# Altium project LPCB281__RLOOP__APU.PrjPCB
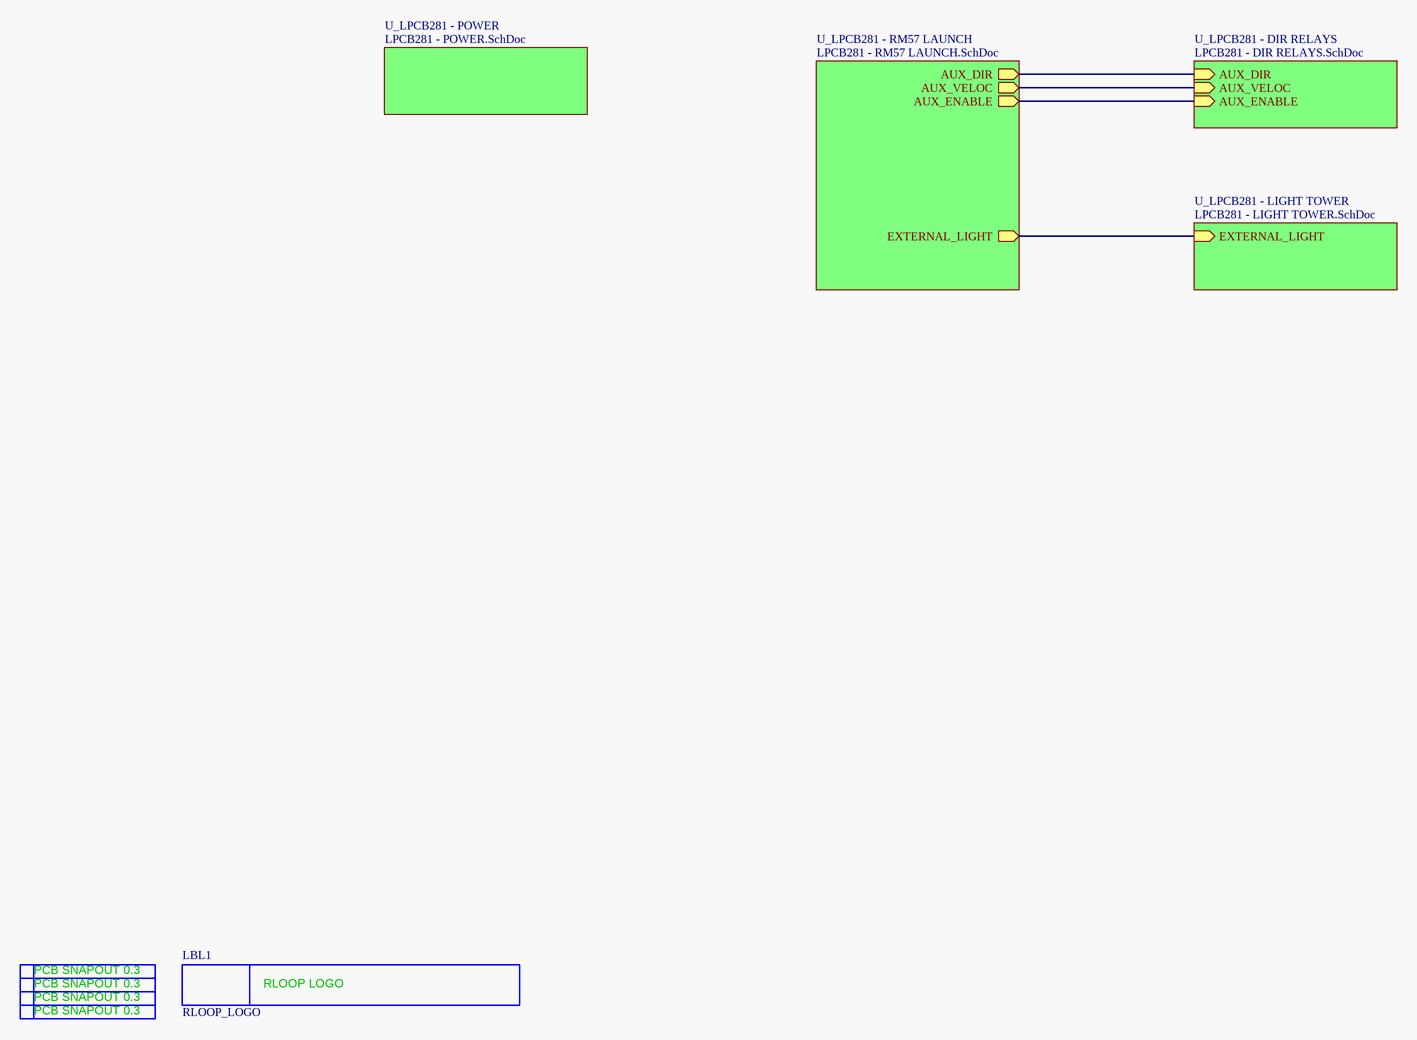
[diagram p0: LPCB281 - TOP.SchDoc]
5 sheets, 39 parts. Net scope: hierarchical (ports join the sheet entries above them; power ports are global).
Board files: LPCB281R0.PcbDoc, LPCB281R0__ASCII.PcbDoc
Sheets:
  LPCB281 - TOP.SchDoc
    U_LPCB281 - RM57 LAUNCH = LPCB281 - RM57 LAUNCH.SchDoc
    U_LPCB281 - POWER = LPCB281 - POWER.SchDoc
    U_LPCB281 - LIGHT TOWER = LPCB281 - LIGHT TOWER.SchDoc
    U_LPCB281 - DIR RELAYS = LPCB281 - DIR RELAYS.SchDoc

## Sheet LPCB281 - TOP.SchDoc
size A3; Address1: Factory 10; Address2: 9-13 Dingley Avenue, Dandeong, VICTORIA 3175, AUSTRALIA; DocumentNumber: 1; Revision: 1; SheetNumber: 1; SheetTotal: 5; Lockie__PCB_SUB_ASSEMBLY: PCB Sub Component; Lockie__PCB_ASSEMBLY: PCB Assembly; Lockie__LDL: LPCB281; Lockie__PCB_DESCRIPTION: Aux Prop Unit (APU)

### Parts
LBL1  RLOOP_LOGO  [RLOOP_LOGO]  (no BOM)
SN1  PCB_SNAPOUT_0.3MM  [PCB_SNAPOUT_0.3MM]  (value not drawn)  (no BOM)
SN2  PCB_SNAPOUT_0.3MM  [PCB_SNAPOUT_0.3MM]  (value not drawn)  (no BOM)
SN3  PCB_SNAPOUT_0.3MM  [PCB_SNAPOUT_0.3MM]  (value not drawn)  (no BOM)
SN4  PCB_SNAPOUT_0.3MM  [PCB_SNAPOUT_0.3MM]  (value not drawn)  (no BOM)

### Sub-sheets
U_LPCB281 - DIR RELAYS = LPCB281 - DIR RELAYS.SchDoc: AUX_DIR (in), AUX_VELOC (in), AUX_ENABLE (in)
U_LPCB281 - LIGHT TOWER = LPCB281 - LIGHT TOWER.SchDoc: EXTERNAL_LIGHT (in)
U_LPCB281 - POWER = LPCB281 - POWER.SchDoc: no entries
U_LPCB281 - RM57 LAUNCH = LPCB281 - RM57 LAUNCH.SchDoc: AUX_VELOC (out), AUX_DIR (out), AUX_ENABLE (out), EXTERNAL_LIGHT (out)

### Nets
AUX_DIR: sheet U_LPCB281 - RM57 LAUNCH/AUX_DIR, sheet U_LPCB281 - DIR RELAYS/AUX_DIR
AUX_ENABLE: sheet U_LPCB281 - RM57 LAUNCH/AUX_ENABLE, sheet U_LPCB281 - DIR RELAYS/AUX_ENABLE
AUX_VELOC: sheet U_LPCB281 - RM57 LAUNCH/AUX_VELOC, sheet U_LPCB281 - DIR RELAYS/AUX_VELOC
NetCN6_J4_8: sheet U_LPCB281 - RM57 LAUNCH/EXTERNAL_LIGHT, sheet U_LPCB281 - LIGHT TOWER/EXTERNAL_LIGHT

### Notes on the sheet
- PCB COMPONENT DESCRIPTION
- LDL NUMBER
- Assembly Details
- Size
- Drawing File Name
- Revision
- http://sil3.com.au
  ACN: 123 529 064
  Factory 10
  9-13 Dingley Avenue
  Dandenong, VICTORIA
  Australia
- Scale
- A3
- Sheet Details
- N.T.S
- Sheet:
- Of:
- (in symbol PCB_SNAPOUT_0.3MM) PCB SNAPOUT 0.3
- (in symbol RLOOP_LOGO) RLOOP LOGO

### Library data of the parts
LBL1 = RLOOP_LOGO: FMEDA__CHANNEL: DIAG; FMEDA__FUNCTION_IN_SYSTEM: *
SN1-SN4 = PCB_SNAPOUT_0.3MM: PCB Snapout + 0.3mm; FMEDA__CHANNEL: DIAG; FMEDA__FUNCTION_IN_SYSTEM: *

## Sheet LPCB281 - RM57 LAUNCH.SchDoc
size A3; Address1: Factory 10; Address2: 9-13 Dingley Avenue, Dandeong, VICTORIA 3175, AUSTRALIA; DocumentNumber: 5; Revision: 1; SheetNumber: 5; SheetTotal: 5; Lockie__PCB_SUB_ASSEMBLY: PCB Sub Component; Lockie__PCB_ASSEMBLY: PCB Assembly; Lockie__LDL: LPCB281; Lockie__PCB_DESCRIPTION: Aux Prop Unit (APU)
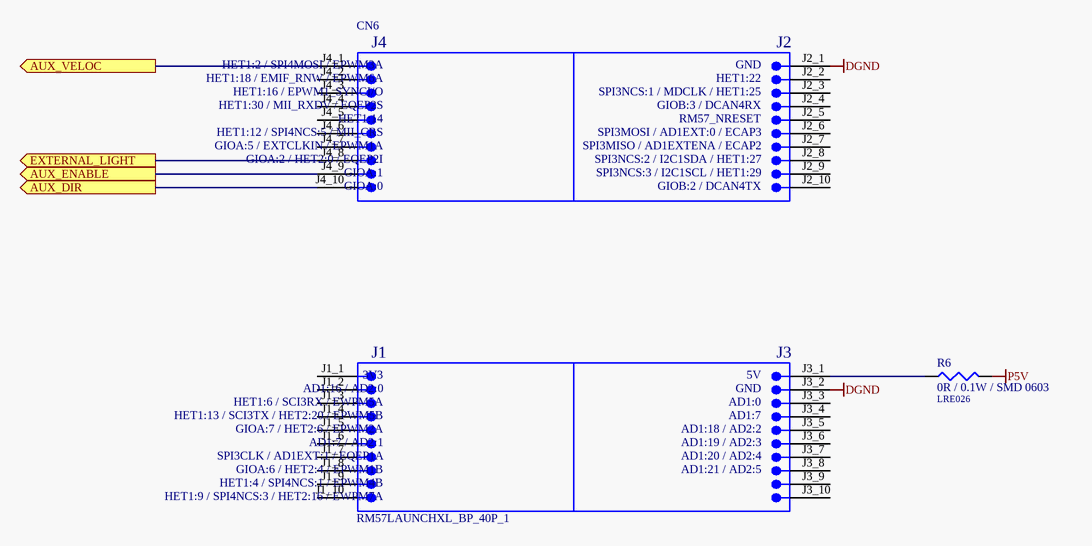
[diagram p1: LPCB281 - RM57 LAUNCH.SchDoc]

### Parts
CN6  RM57LAUNCHXL_BP_40P_1  [RM57LAUNCHXL_BP_40P_1]  (no BOM)
R6  0R / 0.1W / SMD 0603  LDL_NUMBER: LRE026  [LFP020__CR1608-0603-IPC7351_B]

### Ports
AUX_DIR (out), AUX_ENABLE (out), AUX_VELOC (out), EXTERNAL_LIGHT (out)

### Nets
DGND: CN6.J2_1 CN6.J3_2
P5V: R6.2
AUX_DIR: CN6.J4_10 ; port AUX_DIR
AUX_ENABLE: CN6.J4_9 ; port AUX_ENABLE
AUX_VELOC: CN6.J4_1 ; port AUX_VELOC
NetCN6_J3_1: CN6.J3_1 R6.1
NetCN6_J4_8: CN6.J4_8 ; port EXTERNAL_LIGHT

Not connected (* = marked no-connect by the designer): CN6 J1_1 J1_2 J1_3 J1_4 J1_5 J1_6 J1_7 J1_8 J1_9 J1_10 J2_2 J2_3 J2_4 J2_5 J2_6 J2_7 J2_8 J2_9 J2_10 J3_3 J3_4 J3_5 J3_6 J3_7 J3_8 J3_9 J3_10 J4_2 J4_3 J4_4 J4_5 J4_6 J4_7

### Notes on the sheet
- PCB COMPONENT DESCRIPTION
- LDL NUMBER
- Assembly Details
- Size
- Drawing File Name
- Revision
- http://sil3.com.au
  ACN: 123 529 064
  Factory 10
  9-13 Dingley Avenue
  Dandenong, VICTORIA
  Australia
- Scale
- A3
- Sheet Details
- N.T.S
- Sheet:
- Of:
- (in symbol RM57LAUNCHXL_BP_40P_1) J4; J2; HET1:2 / SPI4MOSI / EPWM3A; GND; HET1:18 / EMIF_RNW / EPWM6A; HET1:22; HET1:16 / EPWM1_SYNCI/O; SPI3NCS:1 / MDCLK / HET1:25; HET1:30 / MII_RXDV / EQEP2S; GIOB:3 / DCAN4RX; HET1:14; RM57_NRESET; HET1:12 / SPI4NCS:5 / MII_CRS; SPI3MOSI / AD1EXT:0 / ECAP3; GIOA:5 / EXTCLKIN / EPWM1A; SPI3MISO / AD1EXTENA / ECAP2; GIOA:2 / HET2:0 / EQEP2I; SPI3NCS:2 / I2C1SDA / HET1:27; GIOA:1; SPI3NCS:3 / I2C1SCL / HET1:29; GIOA:0; GIOB:2 / DCAN4TX; J1; J3; 3V3; 5V; AD1:16 / AD2:0; HET1:6 / SCI3RX / EWPM5A; AD1:0; HET1:13 / SCI3TX / HET2:20 / EPWM5B; AD1:7; GIOA:7 / HET2:6 / EPWM2A; AD1:18 / AD2:2; AD1:7 / AD2:1; AD1:19 / AD2:3; SPI3CLK / AD1EXT:1 / EQEP1A; AD1:20 / AD2:4; GIOA:6 / HET2:4 / EPWM1B; AD1:21 / AD2:5; HET1:4 / SPI4NCS:1 / EPWM4B; HET1:9 / SPI4NCS:3 / HET2:16 / EWPM7A

### Library data of the parts
CN6 = RM57LAUNCHXL_BP_40P_1: Connector, RM57L843 LaunchXL, 40Pin Boosterpack Site1; FMEDA__CHANNEL: COM; FMEDA__OPERATING__CURRENT_MAX: 0; FMEDA__OPERATING__TEMP_MAX: 50; FMEDA__OPERATING__TEMP_MIN: -20; FMEDA__OPERATING__TEMP_TYP: 27; FMEDA__OPERATING__VOLTAGE_MAX: 16; FMEDA__OPERATING__VOLTAGE_TYP: 12; FMEDA__FUNCTION_IN_SYSTEM: *; FMEDA__OPERATING__CURRENT_MIN: 0; FMEDA__OPERATING__CURRENT_TYP: 0; FMEDA__OPERATING__VOLTAGE_MIN: 0
R6 = 0R / 0.1W / SMD 0603: Resistor, Ceramic Chip, 0R, 0.1W, SMD 0603 [LRE026]; Value: 0; FMEDA__OPERATING__TEMP_MAX: 50; FMEDA__OPERATING__TEMP_MIN: -20; FMEDA__OPERATING__TEMP_TYP: 27; FMEDA__CHANNEL: COM; FMEDA__OPERATING__POWER_MAX: 0; FMEDA__OPERATING__POWER_MIN: 0; FMEDA__OPERATING__VOLTAGE_MAX: 0; FMEDA__OPERATING__VOLTAGE_MIN: 0; FMEDA__OPERATING__VOLTAGE_TYP: 0; FMEDA__FUNCTION_IN_SYSTEM: *

## Sheet LPCB281 - POWER.SchDoc
size A3; Address1: Factory 10; Address2: 9-13 Dingley Avenue, Dandeong, VICTORIA 3175, AUSTRALIA; DocumentNumber: 4; Revision: 1; SheetNumber: 4; SheetTotal: 5; Lockie__PCB_SUB_ASSEMBLY: PCB Sub Component; Lockie__PCB_ASSEMBLY: PCB Assembly; Lockie__LDL: LPCB281; Lockie__PCB_DESCRIPTION: Aux Prop Unit (APU)
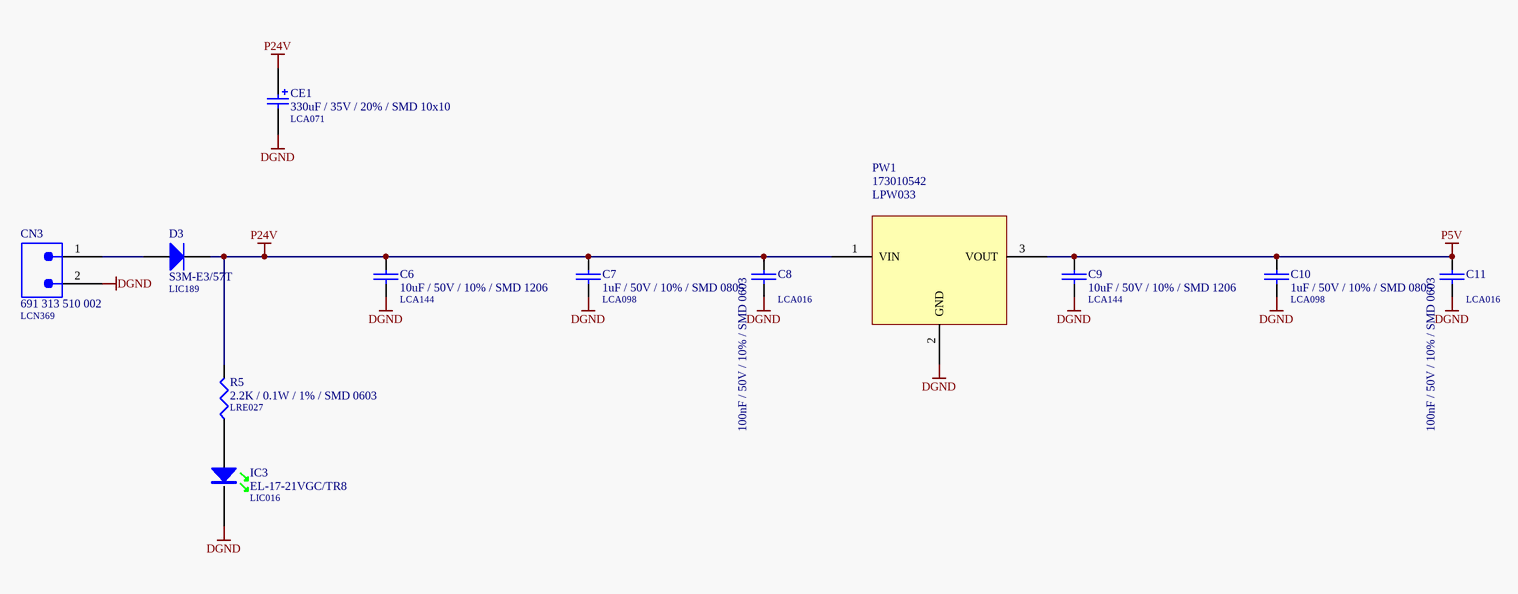
[diagram p2: LPCB281 - POWER.SchDoc]

### Parts
C6  10uF / 50V / 10% / SMD 1206  LDL_NUMBER: LCA144  [LFP043__CC3216-1206]
C7  1uF / 50V / 10% / SMD 0805  LDL_NUMBER: LCA098  [LFP010__CC2012-0805-IPC7351_B]
C8  100nF / 50V / 10% / SMD 0603  LDL_NUMBER: LCA016  [LFP011__CC1608-0603-IPC7351_B]
C9  10uF / 50V / 10% / SMD 1206  LDL_NUMBER: LCA144  [LFP043__CC3216-1206]
C10  1uF / 50V / 10% / SMD 0805  LDL_NUMBER: LCA098  [LFP010__CC2012-0805-IPC7351_B]
C11  100nF / 50V / 10% / SMD 0603  LDL_NUMBER: LCA016  [LFP011__CC1608-0603-IPC7351_B]
CE1  330uF / 35V / 20% / SMD 10x10  LDL_NUMBER: LCA071  [LFP041__NICHICON_WT_10X10]
CN3  691 313 510 002  LDL_NUMBER: LCN369  [691 313 510 002]
D3  S3M-E3/57T  LDL_NUMBER: LIC189  [LFP040__DO-214AB]
IC3  EL-17-21VGC/TR8  LDL_NUMBER: LIC016  [CR2012-0805-LED]
PW1  173010542  LDL_NUMBER: LPW033  [173010542]
R5  2.2K / 0.1W / 1% / SMD 0603  LDL_NUMBER: LRE027  [LFP020__CR1608-0603-IPC7351_B]

### Nets
DGND: C6.2 C7.2 C8.2 C9.2 C10.2 C11.2 CE1.2 CN3.2 IC3.K PW1.2(GND)
P5V: C9.1 C10.1 C11.1 PW1.3(VOUT)
P24V: C6.1 C7.1 C8.1 CE1.1 D3.1(K) PW1.1(VIN) R5.2
NetCN3_1: CN3.1 D3.2(A)
NetIC3_A: IC3.A R5.1

### Notes on the sheet
- PCB COMPONENT DESCRIPTION
- LDL NUMBER
- Assembly Details
- Size
- Drawing File Name
- Revision
- http://sil3.com.au
  ACN: 123 529 064
  Factory 10
  9-13 Dingley Avenue
  Dandenong, VICTORIA
  Australia
- Scale
- A3
- Sheet Details
- N.T.S
- Sheet:
- Of:

### Library data of the parts
C6 C9 = 10uF / 50V / 10% / SMD 1206: Capacitor, Ceramic Chip, 10uF, 50V, X5R, 10%, SMD 1206 [LCA144]; Value: 10u; FMEDA__OPERATING__TEMP_MAX: 85; FMEDA__OPERATING__TEMP_MIN: -55; FMEDA__OPERATING__TEMP_TYP: 27; FMEDA__OPERATING__VOLTAGE_MAX: 50; FMEDA__OPERATING__VOLTAGE_MIN: 0; FMEDA__CHANNEL: COM; FMEDA__FUNCTION_IN_SYSTEM: *
C7 C10 = 1uF / 50V / 10% / SMD 0805: Capacitor, Ceramic Chip, 1uF, 50V, SMD 0805 [LCA098]; Value: 1u; FMEDA__OPERATING__VOLTAGE_MAX: 3.3; FMEDA__OPERATING__VOLTAGE_MIN: 0; FMEDA__OPERATING__TEMP_MAX: 50; FMEDA__OPERATING__TEMP_MIN: -20; FMEDA__OPERATING__TEMP_TYP: 27; FMEDA__CHANNEL: COM; FMEDA__OPERATING__VOLTAGE_TYP: 3.3; FMEDA__FUNCTION_IN_SYSTEM: *
C8 C11 = 100nF / 50V / 10% / SMD 0603: Capacitor, Ceramic Chip, 100nF (0.1uF), 50V, 5%, SMD 0603 [LCA016]; Value: 100n; FMEDA__OPERATING__VOLTAGE_MIN: 0; FMEDA__OPERATING__VOLTAGE_MAX: 3.3; FMEDA__OPERATING__TEMP_MIN: -20; FMEDA__OPERATING__TEMP_TYP: 27; FMEDA__OPERATING__TEMP_MAX: 50; FMEDA__CHANNEL: COM; FMEDA__FUNCTION_IN_SYSTEM: *; FMEDA__OPERATING__VOLTAGE_TYP: 3.3
CE1 = 330uF / 35V / 20% / SMD 10x10: Capacitor, Aluminum Electrolytic, 330uF, 35V, 20%, SMD (10mm x 10mm) [LCA071]; FMEDA__OPERATING__TEMP_MAX: 50; FMEDA__OPERATING__TEMP_MIN: -20; FMEDA__OPERATING__TEMP_TYP: 27; FMEDA__OPERATING__VOLTAGE_MAX: 0; Value: 330u; FMEDA__CHANNEL: COM; FMEDA__OPERATING__VOLTAGE_MIN: 0; FMEDA__OPERATING__VOLTAGE_TYP: 0; FMEDA__FUNCTION_IN_SYSTEM: *
CN3 = 691 313 510 002: Connector, Pluggable Terminal Block, 5.08mm, 2 Way, PTH; FMEDA__CHANNEL: COM; FMEDA__OPERATING__CURRENT_MAX: 0; FMEDA__OPERATING__TEMP_MAX: 50; FMEDA__OPERATING__TEMP_MIN: -20; FMEDA__OPERATING__TEMP_TYP: 27; FMEDA__OPERATING__VOLTAGE_MAX: 16; FMEDA__OPERATING__VOLTAGE_TYP: 12; FMEDA__FUNCTION_IN_SYSTEM: *; FMEDA__OPERATING__CURRENT_MIN: 0; FMEDA__OPERATING__CURRENT_TYP: 0; FMEDA__OPERATING__VOLTAGE_MIN: 0
D3 = S3M-E3/57T: Diode, General Purpose Rectifier, 3A, 200V, SMD DO-214AB [LIC189]; FMEDA__OPERATING__CURRENT_MAX: 0; FMEDA__OPERATING__TEMP_MAX: 50; FMEDA__OPERATING__TEMP_MIN: -20; FMEDA__OPERATING__TEMP_TYP: 27; FMEDA__CHANNEL: COM; FMEDA__OPERATING__CURRENT_MIN: 0; FMEDA__OPERATING__CURRENT_TYP: 0; FMEDA__OPERATING__VOLTAGE_MAX: 0; FMEDA__OPERATING__VOLTAGE_MIN: 0; FMEDA__OPERATING__VOLTAGE_TYP: 0; FMEDA__FUNCTION_IN_SYSTEM: *
IC3 = EL-17-21VGC/TR8: LED, SMD, 0805 Green [LIC016]; FMEDA__OPERATING__TEMP_MAX: 50; FMEDA__OPERATING__TEMP_MIN: -20; FMEDA__OPERATING__TEMP_TYP: 27; FMEDA__CHANNEL: COM; FMEDA__FUNCTION_IN_SYSTEM: *
R5 = 2.2K / 0.1W / 1% / SMD 0603: Resistor, Ceramic Chip, 2.2K, 0.1W, 1%, SMD 0603 [LRE027]; FMEDA__OPERATING__VOLTAGE_MIN: 0; FMEDA__OPERATING__TEMP_MIN: -20; FMEDA__OPERATING__TEMP_TYP: 27; FMEDA__OPERATING__TEMP_MAX: 50; FMEDA__CHANNEL: COM; VALUE: 2.2K; FMEDA__OPERATING__VOLTAGE_MAX: 0; FMEDA__OPERATING__POWER_MIN: 0; FMEDA__OPERATING__POWER_MAX: 0; FMEDA__FUNCTION_IN_SYSTEM: *; FMEDA__OPERATING__VOLTAGE_TYP: 0

## Sheet LPCB281 - LIGHT TOWER.SchDoc
size A3; Address1: Factory 10; Address2: 9-13 Dingley Avenue, Dandeong, VICTORIA 3175, AUSTRALIA; DocumentNumber: 3; Revision: 1; SheetNumber: 3; SheetTotal: 5; Lockie__PCB_SUB_ASSEMBLY: PCB Sub Component; Lockie__PCB_ASSEMBLY: PCB Assembly; Lockie__LDL: LPCB281; Lockie__PCB_DESCRIPTION: Aux Prop Unit (APU)
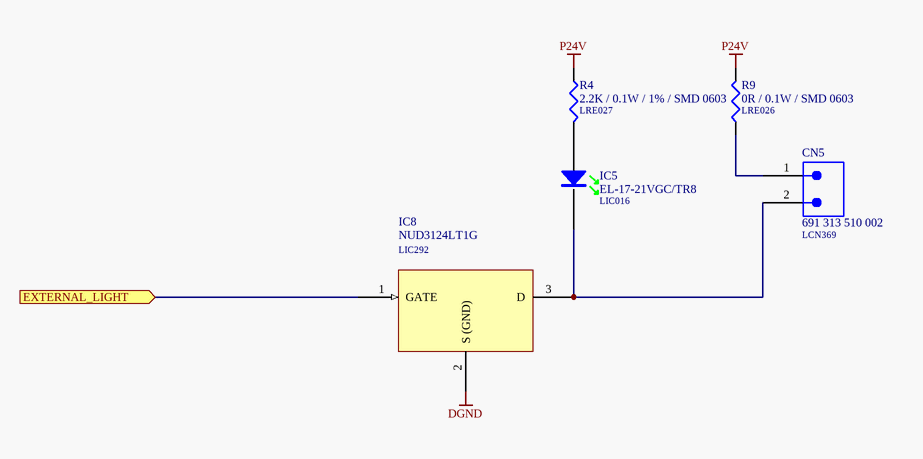
[diagram p3: LPCB281 - LIGHT TOWER.SchDoc]

### Parts
CN5  691 313 510 002  LDL_NUMBER: LCN369  [691 313 510 002]
IC5  EL-17-21VGC/TR8  LDL_NUMBER: LIC016  [CR2012-0805-LED]
IC8  NUD3124LT1G  LDL_NUMBER: LIC292  [LFP021__SOT23]
R4  2.2K / 0.1W / 1% / SMD 0603  LDL_NUMBER: LRE027  [LFP020__CR1608-0603-IPC7351_B]
R9  0R / 0.1W / SMD 0603  LDL_NUMBER: LRE026  [LFP020__CR1608-0603-IPC7351_B]

### Ports
EXTERNAL_LIGHT (in)

### Nets
DGND: IC8.2(S_(GND))
P24V: R4.1 R9.2
NetCN5_1: CN5.1 R9.1
NetCN5_2: CN5.2 IC5.K IC8.3(D)
NetCN6_J4_8: IC8.1(GATE) ; port EXTERNAL_LIGHT
NetIC5_A: IC5.A R4.2

### Notes on the sheet
- PCB COMPONENT DESCRIPTION
- LDL NUMBER
- Assembly Details
- Size
- Drawing File Name
- Revision
- http://sil3.com.au
  ACN: 123 529 064
  Factory 10
  9-13 Dingley Avenue
  Dandenong, VICTORIA
  Australia
- Scale
- A3
- Sheet Details
- N.T.S
- Sheet:
- Of:

### Library data of the parts
CN5 = 691 313 510 002: as CN3 on sheet LPCB281 - POWER; FMEDA__FUNCTION_IN_SYSTEM: *; FMEDA__OPERATING__CURRENT_MIN: 0; FMEDA__OPERATING__CURRENT_TYP: 0; FMEDA__OPERATING__VOLTAGE_MIN: 0
IC5 = EL-17-21VGC/TR8: as IC3 on sheet LPCB281 - POWER; FMEDA__FUNCTION_IN_SYSTEM: *
IC8 = NUD3124LT1G: IC, Relay Driver, 28V Industrial, SMD SOT23 [LIC292]; FMEDA__OPERATING__TEMP_MIN: -20; FMEDA__OPERATING__TEMP_TYP: 27; FMEDA__OPERATING__TEMP_MAX: 50; FMEDA__OPERATING__VOLTAGE_MIN: 0; FMEDA__OPERATING__VOLTAGE_TYP: 13; FMEDA__OPERATING__VOLTAGE_MAX: 18; FMEDA__OPERATING__POWER_TYP: 0.1; FMEDA__OPERATING__POWER_MAX: 0.15; FMEDA__CHANNEL: COM; FMEDA__FUNCTION_IN_SYSTEM: *; FMEDA__OPERATING__POWER_MIN: 0
R4 = 2.2K / 0.1W / 1% / SMD 0603: as R5 on sheet LPCB281 - POWER; VALUE: 2.2K; FMEDA__OPERATING__VOLTAGE_MAX: 0; FMEDA__OPERATING__POWER_MIN: 0; FMEDA__OPERATING__POWER_MAX: 0; FMEDA__FUNCTION_IN_SYSTEM: *; FMEDA__OPERATING__VOLTAGE_TYP: 0
R9 = 0R / 0.1W / SMD 0603: as R6 on sheet LPCB281 - RM57 LAUNCH; FMEDA__OPERATING__POWER_MAX: 0; FMEDA__OPERATING__POWER_MIN: 0; FMEDA__OPERATING__VOLTAGE_MAX: 0; FMEDA__OPERATING__VOLTAGE_MIN: 0; FMEDA__OPERATING__VOLTAGE_TYP: 0; FMEDA__FUNCTION_IN_SYSTEM: *

## Sheet LPCB281 - DIR RELAYS.SchDoc
size A3; Address1: Factory 10; Address2: 9-13 Dingley Avenue, Dandeong, VICTORIA 3175, AUSTRALIA; DocumentNumber: 2; Revision: 1; SheetNumber: 2; SheetTotal: 5; Lockie__PCB_SUB_ASSEMBLY: PCB Sub Component; Lockie__PCB_ASSEMBLY: PCB Assembly; Lockie__LDL: LPCB281; Lockie__PCB_DESCRIPTION: Aux Prop Unit (APU)
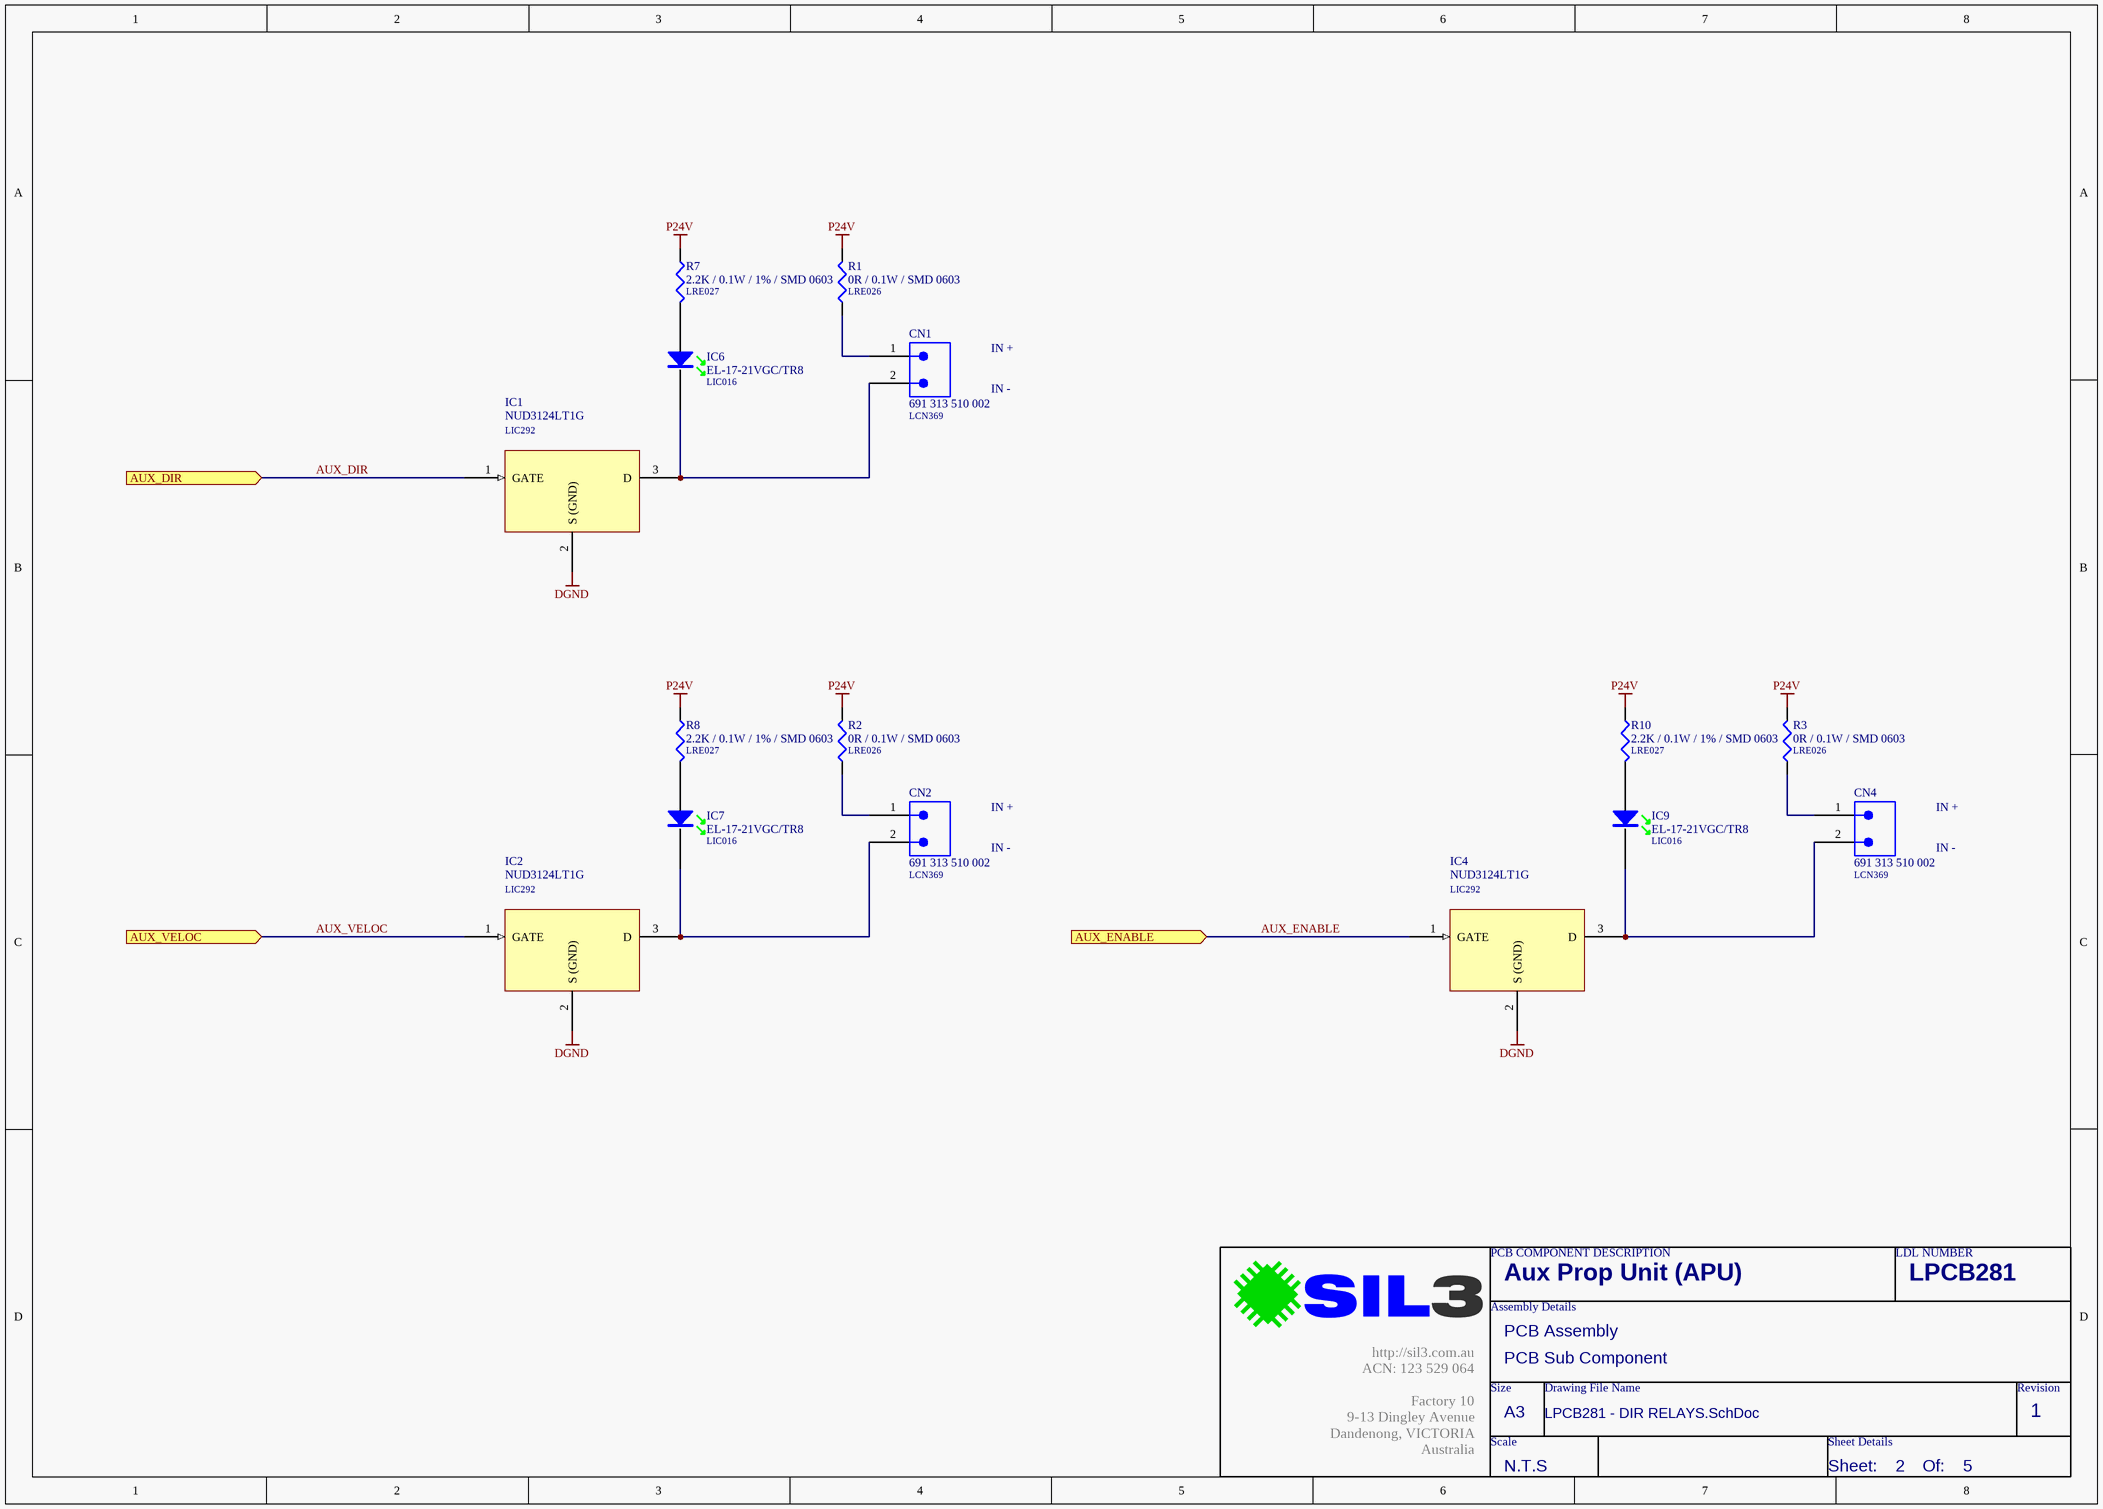
[diagram p4: LPCB281 - DIR RELAYS.SchDoc]

### Parts
CN1  691 313 510 002  LDL_NUMBER: LCN369  [691 313 510 002]
CN2  691 313 510 002  LDL_NUMBER: LCN369  [691 313 510 002]
CN4  691 313 510 002  LDL_NUMBER: LCN369  [691 313 510 002]
IC1  NUD3124LT1G  LDL_NUMBER: LIC292  [LFP021__SOT23]
IC2  NUD3124LT1G  LDL_NUMBER: LIC292  [LFP021__SOT23]
IC4  NUD3124LT1G  LDL_NUMBER: LIC292  [LFP021__SOT23]
IC6  EL-17-21VGC/TR8  LDL_NUMBER: LIC016  [CR2012-0805-LED]
IC7  EL-17-21VGC/TR8  LDL_NUMBER: LIC016  [CR2012-0805-LED]
IC9  EL-17-21VGC/TR8  LDL_NUMBER: LIC016  [CR2012-0805-LED]
R1  0R / 0.1W / SMD 0603  LDL_NUMBER: LRE026  [LFP020__CR1608-0603-IPC7351_B]
R2  0R / 0.1W / SMD 0603  LDL_NUMBER: LRE026  [LFP020__CR1608-0603-IPC7351_B]
R3  0R / 0.1W / SMD 0603  LDL_NUMBER: LRE026  [LFP020__CR1608-0603-IPC7351_B]
R7  2.2K / 0.1W / 1% / SMD 0603  LDL_NUMBER: LRE027  [LFP020__CR1608-0603-IPC7351_B]
R8  2.2K / 0.1W / 1% / SMD 0603  LDL_NUMBER: LRE027  [LFP020__CR1608-0603-IPC7351_B]
R10  2.2K / 0.1W / 1% / SMD 0603  LDL_NUMBER: LRE027  [LFP020__CR1608-0603-IPC7351_B]

### Ports
AUX_DIR (in), AUX_ENABLE (in), AUX_VELOC (in)

### Nets
DGND: IC1.2(S_(GND)) IC2.2(S_(GND)) IC4.2(S_(GND))
P24V: R1.2 R2.2 R3.2 R7.1 R8.1 R10.1
AUX_DIR: IC1.1(GATE) ; port AUX_DIR
AUX_ENABLE: IC4.1(GATE) ; port AUX_ENABLE
AUX_VELOC: IC2.1(GATE) ; port AUX_VELOC
NetCN1_1: CN1.1 R1.1
NetCN1_2: CN1.2 IC1.3(D) IC6.K
NetCN2_1: CN2.1 R2.1
NetCN2_2: CN2.2 IC2.3(D) IC7.K
NetCN4_1: CN4.1 R3.1
NetCN4_2: CN4.2 IC4.3(D) IC9.K
NetIC6_A: IC6.A R7.2
NetIC7_A: IC7.A R8.2
NetIC9_A: IC9.A R10.2

### Notes on the sheet
- IN +
- IN -
- PCB COMPONENT DESCRIPTION
- LDL NUMBER
- Assembly Details
- Size
- Drawing File Name
- Revision
- http://sil3.com.au
  ACN: 123 529 064
  Factory 10
  9-13 Dingley Avenue
  Dandenong, VICTORIA
  Australia
- Scale
- A3
- Sheet Details
- N.T.S
- Sheet:
- Of:

### Library data of the parts
CN1 CN2 CN4 = 691 313 510 002: as CN3 on sheet LPCB281 - POWER; FMEDA__FUNCTION_IN_SYSTEM: *; FMEDA__OPERATING__CURRENT_MIN: 0; FMEDA__OPERATING__CURRENT_TYP: 0; FMEDA__OPERATING__VOLTAGE_MIN: 0
IC1 IC2 IC4 = NUD3124LT1G: as IC8 on sheet LPCB281 - LIGHT TOWER; FMEDA__FUNCTION_IN_SYSTEM: *; FMEDA__OPERATING__POWER_MIN: 0
IC6 IC7 IC9 = EL-17-21VGC/TR8: as IC3 on sheet LPCB281 - POWER; FMEDA__FUNCTION_IN_SYSTEM: *
R1-R3 = 0R / 0.1W / SMD 0603: as R6 on sheet LPCB281 - RM57 LAUNCH; FMEDA__OPERATING__POWER_MAX: 0; FMEDA__OPERATING__POWER_MIN: 0; FMEDA__OPERATING__VOLTAGE_MAX: 0; FMEDA__OPERATING__VOLTAGE_MIN: 0; FMEDA__OPERATING__VOLTAGE_TYP: 0; FMEDA__FUNCTION_IN_SYSTEM: *
R7 R8 R10 = 2.2K / 0.1W / 1% / SMD 0603: as R5 on sheet LPCB281 - POWER; VALUE: 2.2K; FMEDA__OPERATING__VOLTAGE_MAX: 0; FMEDA__OPERATING__POWER_MIN: 0; FMEDA__OPERATING__POWER_MAX: 0; FMEDA__FUNCTION_IN_SYSTEM: *; FMEDA__OPERATING__VOLTAGE_TYP: 0

## Nets that join several sheets
DGND: LPCB281 - RM57 LAUNCH (CN6.J2_1 CN6.J3_2), LPCB281 - POWER (10 pins), LPCB281 - LIGHT TOWER (IC8.2), LPCB281 - DIR RELAYS (IC1.2 IC2.2 IC4.2)
P5V: LPCB281 - RM57 LAUNCH (R6.2), LPCB281 - POWER (C9.1 C10.1 C11.1 PW1.3)
P24V: LPCB281 - POWER (7 pins), LPCB281 - LIGHT TOWER (R4.1 R9.2), LPCB281 - DIR RELAYS (6 pins)
AUX_DIR: LPCB281 - RM57 LAUNCH (CN6.J4_10), LPCB281 - DIR RELAYS (IC1.1)
AUX_ENABLE: LPCB281 - RM57 LAUNCH (CN6.J4_9), LPCB281 - DIR RELAYS (IC4.1)
AUX_VELOC: LPCB281 - RM57 LAUNCH (CN6.J4_1), LPCB281 - DIR RELAYS (IC2.1)
NetCN6_J4_8: LPCB281 - RM57 LAUNCH (CN6.J4_8), LPCB281 - LIGHT TOWER (IC8.1)